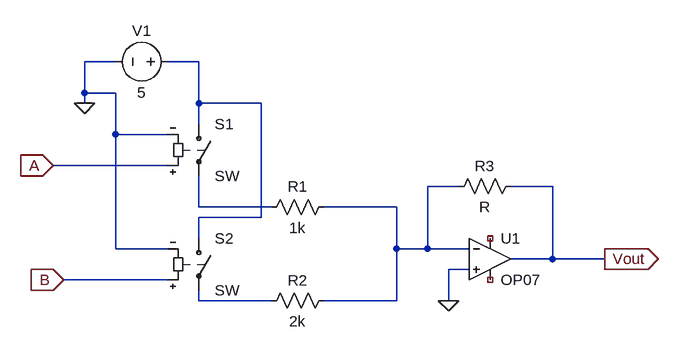
[diagram p0: schematic Draft1.asc]
Draft1.asc, the LTspice schematic file:
Version 4
SHEET 1 880 680
WIRE -272 -128 -320 -128
WIRE -144 -128 -192 -128
WIRE -320 -80 -320 -128
WIRE -272 -80 -320 -80
WIRE -320 -64 -320 -80
WIRE -144 -64 -144 -128
WIRE -48 -64 -144 -64
WIRE -144 -32 -144 -64
WIRE -272 -16 -272 -80
WIRE -192 -16 -272 -16
WIRE -192 32 -368 32
WIRE 256 64 208 64
WIRE 400 64 336 64
WIRE -144 96 -144 48
WIRE -32 96 -144 96
WIRE 160 96 48 96
WIRE -48 112 -48 -64
WIRE -48 112 -144 112
WIRE -144 144 -144 112
WIRE -272 160 -272 -16
WIRE -192 160 -272 160
WIRE 160 160 160 96
WIRE 208 160 208 64
WIRE 208 160 160 160
WIRE 272 160 208 160
WIRE 400 176 400 64
WIRE 400 176 336 176
WIRE 480 176 400 176
WIRE 272 192 240 192
WIRE -192 208 -352 208
WIRE -144 240 -144 224
WIRE -32 240 -144 240
WIRE 160 240 160 160
WIRE 160 240 48 240
WIRE 240 240 240 192
FLAG 240 240 0
FLAG 480 176 Vout
IOPIN 480 176 Out
FLAG -320 -64 0
FLAG -368 32 A
IOPIN -368 32 In
FLAG -352 208 B
IOPIN -352 208 In
SYMBOL res 64 80 R90
WINDOW 0 0 56 VBottom 2
WINDOW 3 32 56 VTop 2
SYMATTR InstName R1
SYMATTR Value 1k
SYMBOL res 64 224 R90
WINDOW 0 0 56 VBottom 2
WINDOW 3 32 56 VTop 2
SYMATTR InstName R2
SYMATTR Value 2k
SYMBOL Opamps\\OP07 304 112 R0
SYMATTR InstName U1
SYMBOL res 352 48 R90
WINDOW 0 0 56 VBottom 2
WINDOW 3 32 56 VTop 2
SYMATTR InstName R3
SYMBOL sw -144 -48 R0
SYMATTR InstName S1
SYMBOL voltage -176 -128 R90
WINDOW 0 -32 56 VBottom 2
WINDOW 3 32 56 VTop 2
WINDOW 123 0 0 Left 0
WINDOW 39 0 0 Left 0
SYMATTR InstName V1
SYMATTR Value 5
SYMBOL sw -144 128 R0
SYMATTR InstName S2

The netlist it stands for:
* Draft1.asc
R1 N002 N003 1k
R2 N002 N004 2k
XU1 0 N002 NC_01 NC_02 Vout LT1001  ; OP07, pins In+ In- V+ V- OUT
R3 Vout N002 R
S1 N001 N003 A 0 SW
V1 N001 0 5
S2 N001 N004 B 0 SW
.lib LTC.lib
.backanno
.end